# EAGLE design ATmega128RFA1 Dev Board-v11 (EAGLE 5.10)
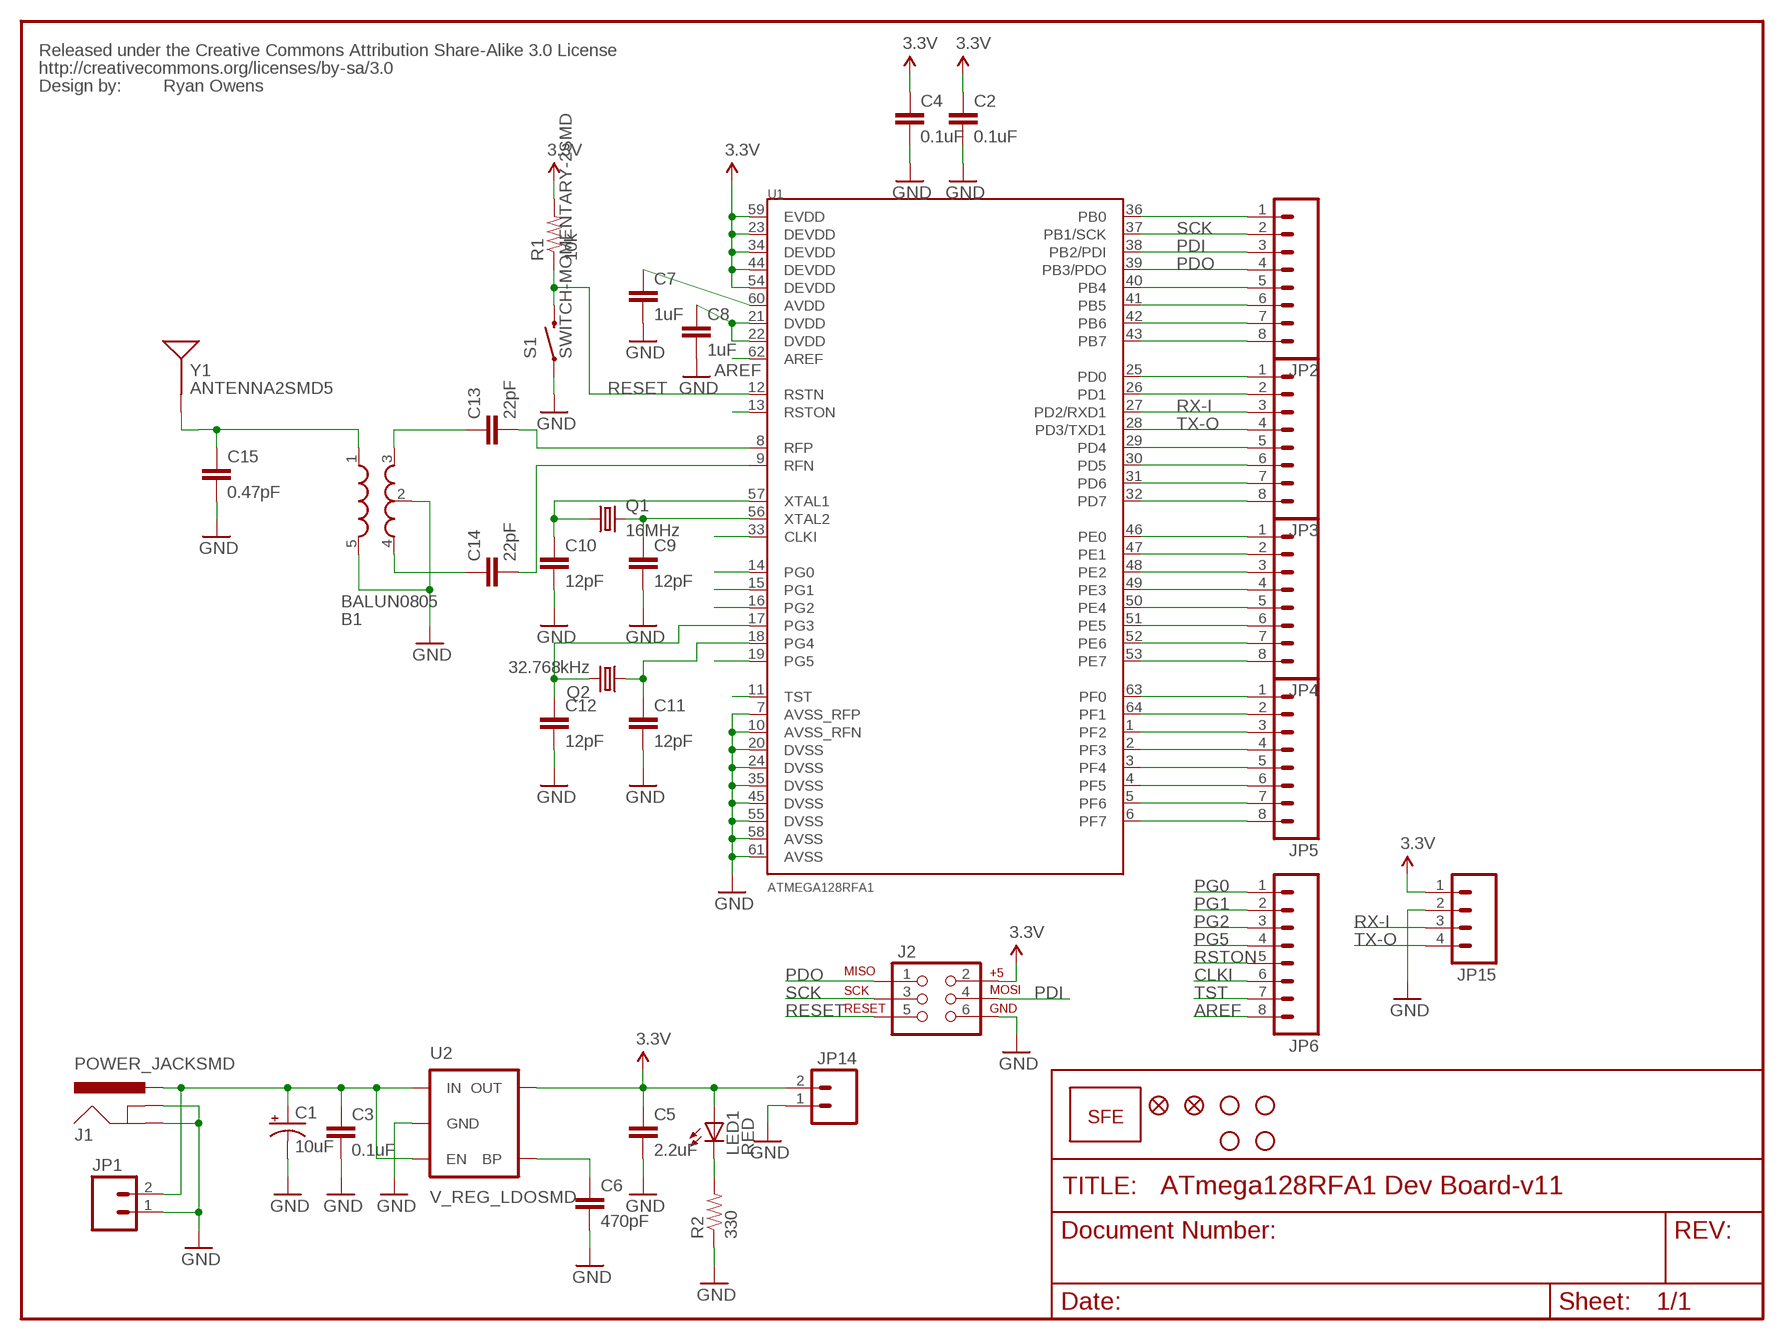
[diagram p0: schematic, sheet 1]

## Parts
B1  BALUN0805  [BALUN]
C1  10uF  CAP_POL1206  [EIA3216]
C2  0.1uF  CAP0603-CAP  [0603-CAP]
C3  0.1uF  CAP0603-CAP  [0603-CAP]
C4  0.1uF  CAP0603-CAP  [0603-CAP]
C5  2.2uF  CAP0603-CAP  [0603-CAP]
C6  470pF  CAP0603-CAP  [0603-CAP]
C7  1uF  CAP0805  [0805]
C8  1uF  CAP0805  [0805]
C9  12pF  CAP0603-CAP  [0603-CAP]
C10  12pF  CAP0603-CAP  [0603-CAP]
C11  12pF  CAP0603-CAP  [0603-CAP]
C12  12pF  CAP0603-CAP  [0603-CAP]
C13  22pF  CAP0603-CAP  [0603-CAP]
C14  22pF  CAP0603-CAP  [0603-CAP]
C15  0.47pF  CAP0603-CAP  [0603-CAP]
J1  POWER_JACKSMD  [POWER_JACK_SMD]
J2  AVR_SPI_PRG_6PTH  [2X3]
JP1  M02PTH  [1X02]
JP2  M08  [1X08]
JP3  M08  [1X08]
JP4  M08  [1X08]
JP5  M08  [1X08]
JP6  M08  [1X08]
JP7  LOGO-SFENEW  [SFE-NEW-WEBLOGO]
JP8  FIDUCIAL1X2  [FIDUCIAL-1X2]
JP9  FIDUCIAL1X2  [FIDUCIAL-1X2]
JP10  STAND-OFF  [STAND-OFF]
JP11  STAND-OFF  [STAND-OFF]
JP12  STAND-OFF  [STAND-OFF]
JP13  STAND-OFF  [STAND-OFF]
JP14  M02PTH  [1X02]
JP15  M04PTH  [1X04]
LED1  RED  LED0603  [LED-0603]
Q1  16MHz  CRYSTAL5X3  [CRYSTAL-SMD-5X3]
Q2  32.768kHz  CRYSTAL32-SMD  [CRYSTAL-32KHZ-SMD]
R1  10k  RESISTOR0603-RES  [0603-RES]
R2  330  RESISTOR0603-RES  [0603-RES]
S1  SWITCH-MOMENTARY-2SMD  [TACTILE_SWITCH_SMD]
U1  ATMEGA128RFA1  [QFN-64]
U2  V_REG_LDOSMD  [SOT23-5]
U$1  CREATIVE_COMMONS  [CREATIVE_COMMONS]
Y1  ANTENNA2SMD5  [ANTENNA-CHIP5]

## Nets
3.3V [Supply]: C2.1 C4.1 C5.1 J2.2 JP14.2 JP15.1 LED1.A R1.2 U1.23(DEVDD) U1.34(DEVDD) U1.44(DEVDD) U1.54(DEVDD) U1.59(EVDD) U2.5(OUT)
AREF: JP6.8 U1.62(AREF)
CLKI: JP6.6 U1.33(CLKI)
GND [Supply]: B1.2(GND) B1.5(GND) C1.C(-) C2.2 C3.2 C4.2 C5.2 C6.2 C7.2 C8.2 C9.2 C10.2 C11.2 C12.2 C15.2 J1.GND(GNDBREAK) J1.P$4(GND) J2.6 JP1.1 JP14.1 JP15.2 R2.1 S1.1 U1.7(AVSS_RFP) U1.10(AVSS_RFN) U1.20(DVSS) U1.24(DVSS) U1.35(DVSS) U1.45(DVSS) U1.55(DVSS) U1.58(AVSS) U1.61(AVSS) U2.2(GND)
N$1: B1.3(OUT1) C13.1
N$2: B1.4(OUT2) C14.1
N$3 [Supply]: C1.A(+) C3.1 J1.VIN0(PWR) JP1.2 U2.1(IN) U2.3(EN)
N$4: B1.1(IN) C15.1 Y1.FEED(SIGNAL)
N$5: C8.1 U1.21(DVDD) U1.22(DVDD)
N$6: C14.2 U1.9(RFN)
N$7: C13.2 U1.8(RFP)
N$8: LED1.C R2.2
N$10: C7.1 U1.60(AVDD)
N$12: C10.1 Q1.1 U1.57(XTAL1)
N$13: C9.1 Q1.3 U1.56(XTAL2)
N$14: C12.1 Q2.X2 U1.17(PG3)
N$15: C11.1 Q2.X1 U1.18(PG4)
N$16: C6.1 U2.4(BP)
N$17: JP2.1 U1.36(PB0)
N$21: JP2.5 U1.40(PB4)
N$22: JP2.6 U1.41(PB5)
N$23: JP2.7 U1.42(PB6)
N$24: JP2.8 U1.43(PB7)
N$25: JP3.1 U1.25(PD0)
N$26: JP3.2 U1.26(PD1)
N$29: JP3.5 U1.29(PD4)
N$30: JP3.6 U1.30(PD5)
N$31: JP3.7 U1.31(PD6)
N$32: JP3.8 U1.32(PD7)
N$33: JP4.1 U1.46(PE0)
N$34: JP4.2 U1.47(PE1)
N$35: JP4.3 U1.48(PE2)
N$36: JP4.4 U1.49(PE3)
N$37: JP4.5 U1.50(PE4)
N$38: JP4.6 U1.51(PE5)
N$39: JP4.7 U1.52(PE6)
N$40: JP4.8 U1.53(PE7)
N$41: JP5.1 U1.63(PF0)
N$42: JP5.2 U1.64(PF1)
N$43: JP5.3 U1.1(PF2)
N$44: JP5.4 U1.2(PF3)
N$45: JP5.5 U1.3(PF4)
N$46: JP5.6 U1.4(PF5)
N$47: JP5.7 U1.5(PF6)
N$48: JP5.8 U1.6(PF7)
PDI: J2.4 JP2.3 U1.38(PB2/PDI)
PDO: J2.1 JP2.4 U1.39(PB3/PDO)
PG0: JP6.1 U1.14(PG0)
PG1: JP6.2 U1.15(PG1)
PG2: JP6.3 U1.16(PG2)
PG5: JP6.4 U1.19(PG5)
RESET: J2.5 R1.1 S1.3 U1.12(RSTN)
RSTON: JP6.5 U1.13(RSTON)
RX-I: JP3.3 JP15.3 U1.27(PD2/RXD1)
SCK: J2.3 JP2.2 U1.37(PB1/SCK)
TST: JP6.7 U1.11(TST)
TX-O: JP3.4 JP15.4 U1.28(PD3/TXD1)

## Notes on the sheet
- Ryan Owens

## Library data of the parts
B1 = SparkFun:BALUN
C1 = SparkFun:CAP_POL: Capacitor Polarized These are standard SMD and PTH capacitors. Normally 10uF, 47uF, and 100uF in electrolytic and tantalum varieties. Always verify the external diameter of the through hole cap, it varies with capacity, voltage, and manufacturer. The EIA devices should be standard.
C2-C15 = SparkFun:CAP: Capacitor Standard 0603 ceramic capacitor, and 0.1" leaded capacitor.
J1 = SparkFun:POWER_JACK: Power Jack This is the standard 5.5mm barrel jack for power. The PTH is the most common, proven, reliable, footprint. All others are experimental. The Slot footprint only works if the mill layer is transmitted to the PCB fab house so be warned. Spark Fun Electronics SKU : PRT-00119. Mating wall wart : TOL-00298 (and others)
J2 = SparkFun:AVR_SPI_PRG_6: AVR ISP 6 Pin This is the reduced ISP connector for AVR programming. Common on Arduino. This footprint will take up less PCB space and can be used with a 10-pin to 6-pin adapter such as SKU: BOB-08508
JP1 JP14 = SparkFun:M02: Header 2 Standard 2-pin 0.1" header. Use with straight break away headers (SKU : PRT-00116), right angle break away headers (PRT-00553), swiss pins (PRT-00743), machine pins (PRT-00117), and female headers (PRT-00115). Molex polarized connector foot print use with SKU : PRT-08233 with associated crimp pins and housings.
JP2-JP6 = SparkFun:M08: Header 8 Standard 8-pin 0.1" header. Use with straight break away headers (SKU : PRT-00116), right angle break away headers (PRT-00553), swiss pins (PRT-00743), machine pins (PRT-00117), and female headers (PRT-00115).
JP7 = SparkFun:LOGO-SFE: Spark Fun Electronics PCB Logo This is the standard Spark Fun Electronics PCB logo.
JP8 JP9 = SparkFun:FIDUCIAL: Fiducial Alignment Points Various fiducial points for machine vision alignment.
JP10-JP13 = SparkFun:STAND-OFF: Stand Off This is the mechanical footprint for a #4 phillips button head screw. Use the keepout ring to avoid running the screw head into surrounding components. SKU : PRT-00447
JP15 = SparkFun:M04: Header 4 Standard 4-pin 0.1" header. Use with straight break away headers (SKU : PRT-00116), right angle break away headers (PRT-00553), swiss pins (PRT-00743), machine pins (PRT-00117), and female headers (PRT-00115). Molex polarized connector foot print use with SKU : PRT-08231 with associated crimp pins and housings.
LED1 = SparkFun:LED: LEDs Standard schematic elements and footprints for 5mm, 3mm, 1206, and 0603 sized LEDs. 5mm - Spark Fun Electronics SKU : COM-00529 (and others)
Q1 Q2 = SparkFun:CRYSTAL: Crystals Various standard crystals. Proven footprints. Spark Fun Electronics SKU : COM-00534
R1 R2 = SparkFun:RESISTOR: Resistor Basic schematic elements and footprints for 0603, 1206, and PTH 1/10th watt (small) resistors.
S1 = SparkFun:SWITCH-MOMENTARY-2
U1 = SparkFun:ATMEGA128RFA1
U2 = SparkFun:V_REG_LDO: Voltage Regulator LDO Standard 150mA LDO voltage regulator in SOT-23 layout. Micrel part MIC5205. BP (by-pass) pin is used to lower output noise with 470pF cap.
U$1 = SparkFun:CREATIVE_COMMONS
Y1 = SparkFun:ANTENNA2: Antenna Single endded antenna. Common with smaller chip antennas. CHIP4 package is the GPS Chip Antenna SKU: GPS-08418. CHIP5 package is 2.4GHz chip antenna SKU: WRL-00144.

## Net classes
1 Supply: width 0.406 mm

## Board
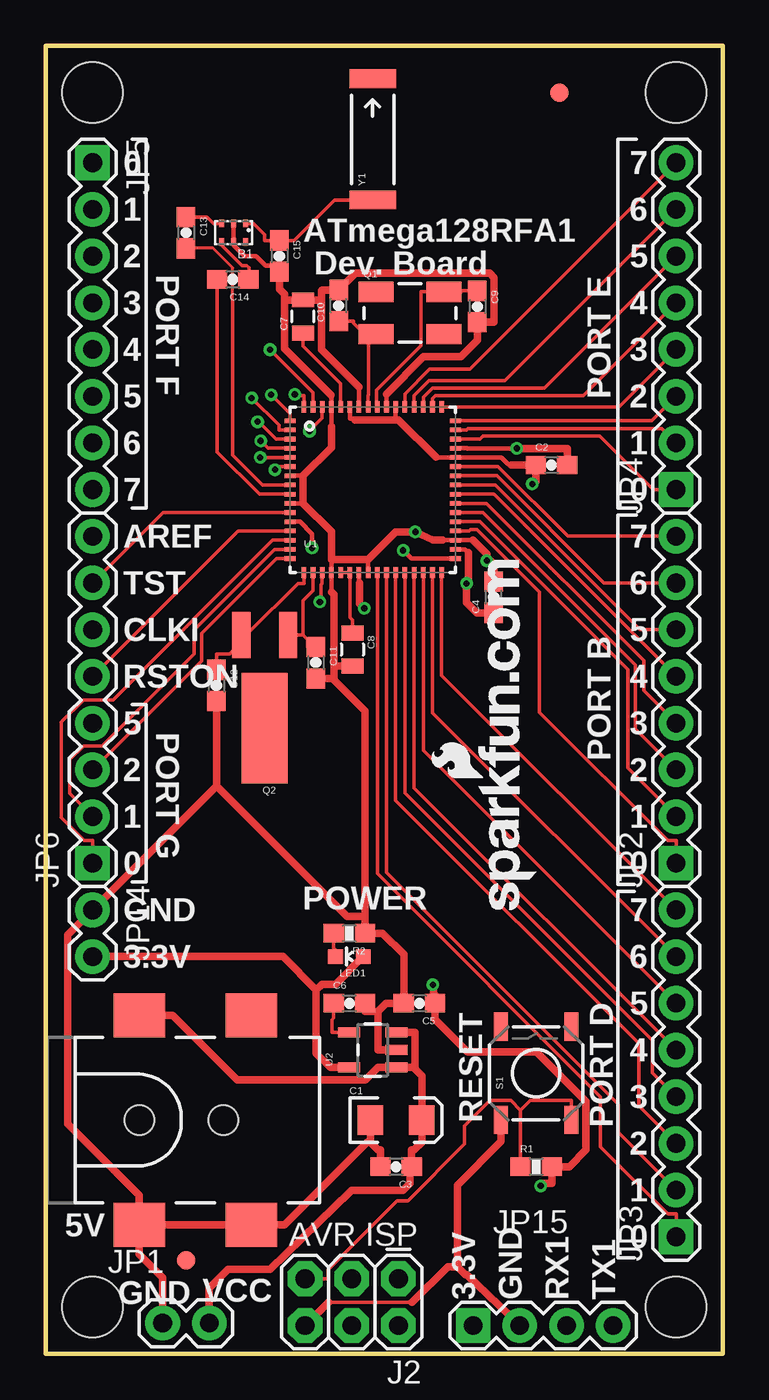
[diagram p1: board, top side]
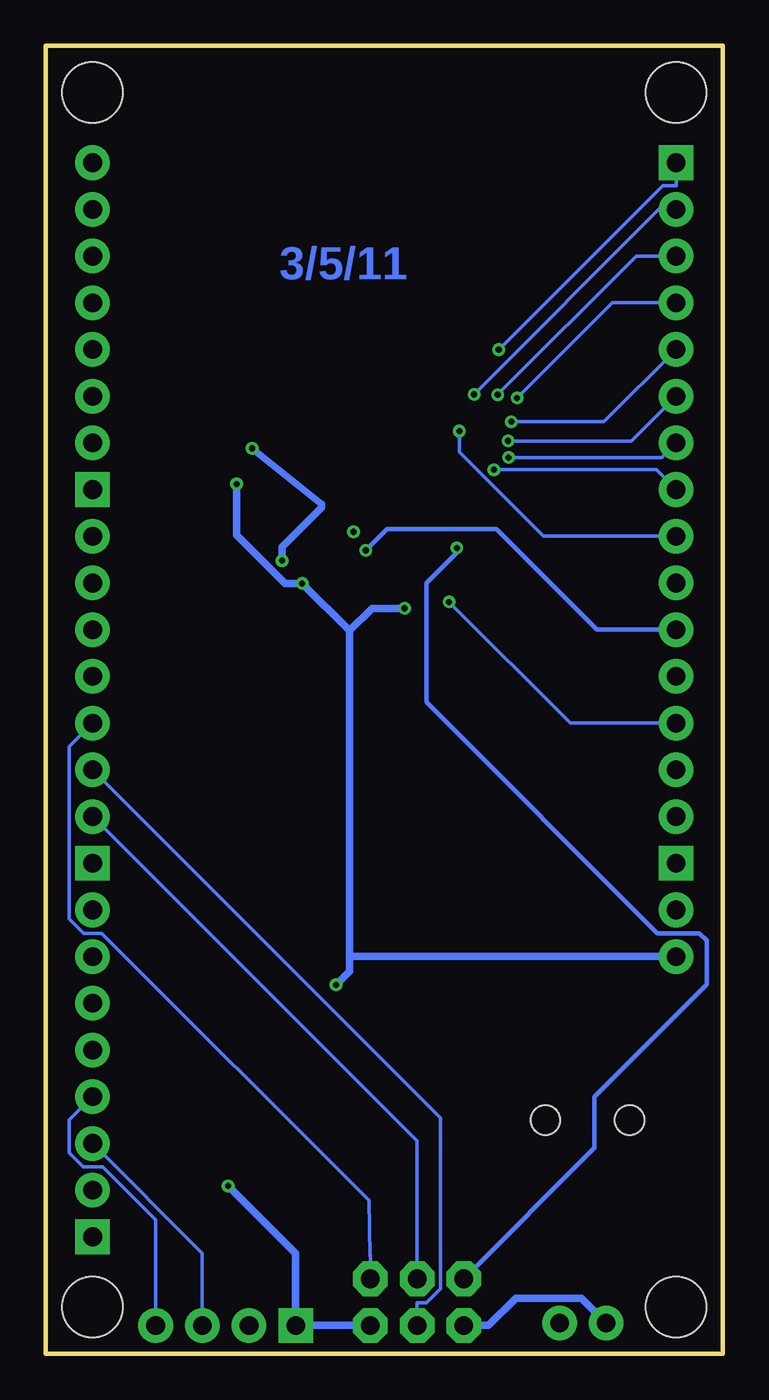
[diagram p2: board, bottom side, seen from below]

Size 36.83 x 71.12 mm. Coordinates in mm from the lower left corner, seen from the top.
Outline: 0,0 0,71.12 36.83,71.12 36.83,0 0,0
Copper layers (1*16): Top 0.0356mm / dielectric 1.5011mm / Bottom 0.0356mm
Design rules "LaenPCBOrder8mil": minimum track width 8mil, minimum drill 13mil, track to track 8mil, track to pad 8mil, pad to pad 8mil, via to via 8mil, smd to smd 6mil, copper to edge 15mil, drill to drill 6mil, minimum pad ring 8mil, minimum via ring 7mil, stop-mask expansion 4mil, vias tented up to drill 0mil, thermal gap 10mil

### Footprints (pad centres in the part's own frame; a part is rotated, then mirrored left to right if it is on the bottom)
BALUN = smd 0.27 x 0.4: 1 -0.7,-0.5; 2 -0.05,-0.5; 3 0.6,-0.5; 4 0.6,0.5; 5 -0.05,0.5; 6 -0.7,0.5
EIA3216 = smd 1.4 x 1.6: A 1.4,0; C -1.4,0
0603-CAP = smd 1.1 x 1: 1 -0.85,0; 2 0.85,0
0805 = smd 0.8 x 1.2: 1 -0.9,0; 2 0.9,0
POWER_JACK_SMD = smd 2.8 x 2.4: GND 0,-5.7; P$4 6.1,-5.7; VIN0 0,5.7; VIN1 6.1,5.7 | hole 1.6: 0,0; 4.572,0
2X3 = drill 1.016 pad 1.88 octagon: 1 0,0; 2 0,2.54; 3 2.54,0; 4 2.54,2.54; 5 5.08,0; 6 5.08,2.54
1X02 = drill 1.016 pad 1.88 round: 1 0,0; 2 2.54,0
1X08 = drill 1.016 pad 1.88 square: 1 0,0 | drill 1.016 pad 1.88 round: 2 2.54,0; 3 5.08,0; 4 7.62,0; 5 10.16,0; 6 12.7,0; 7 15.24,0; 8 17.78,0
FIDUCIAL-1X2 = smd 1 x 1: 1 0,0
STAND-OFF = hole 3.302: 0,0
1X04 = drill 1.016 pad 1.88 square: 1 0,0 | drill 1.016 pad 1.88 round: 2 2.54,0; 3 5.08,0; 4 7.62,0
LED-0603 = smd 0.8 x 0.8: A 0,-0.75; C 0,0.75
CRYSTAL-SMD-5X3 = smd 1.9 x 1.1: 1 -1.85,-1.15; 2 1.85,-1.15; 3 1.85,1.15; 4 -1.85,1.15
CRYSTAL-32KHZ-SMD = smd 2.5 x 6: SHEILD 0,5.08 | smd 1 x 2.5: X1 -1.27,0; X2 1.27,0
0603-RES = smd 1.1 x 1: 1 -0.85,0; 2 0.85,0
TACTILE_SWITCH_SMD = smd 1.524 x 0.762: 1 -2.54,1.905; 2 2.54,1.905; 3 -2.54,-1.905; 4 2.54,-1.905
QFN-64 = smd 0.6 x 0.25: 1 -4.5,3.75; 2 -4.5,3.25; 3 -4.5,2.75; 4 -4.5,2.25; 5 -4.5,1.75; 6 -4.5,1.25; 7 -4.5,0.75; 8 -4.5,0.25; 9 -4.5,-0.25; 10 -4.5,-0.75; 11 -4.5,-1.25; 12 -4.5,-1.75; 13 -4.5,-2.25; 14 -4.5,-2.75; 15 -4.5,-3.25; 16 -4.5,-3.75; 33 4.5,-3.75; 34 4.5,-3.25; 35 4.5,-2.75; 36 4.5,-2.25; 37 4.5,-1.75; 38 4.5,-1.25; 39 4.5,-0.75; 40 4.5,-0.25; 41 4.5,0.25; 42 4.5,0.75; 43 4.5,1.25; 44 4.5,1.75; 45 4.5,2.25; 46 4.5,2.75; 47 4.5,3.25; 48 4.5,3.75 | smd 0.25 x 0.6: 17 -3.75,-4.5; 18 -3.25,-4.5; 19 -2.75,-4.5; 20 -2.25,-4.5; 21 -1.75,-4.5; 22 -1.25,-4.5; 23 -0.75,-4.5; 24 -0.25,-4.5; 25 0.25,-4.5; 26 0.75,-4.5; 27 1.25,-4.5; 28 1.75,-4.5; 29 2.25,-4.5; 30 2.75,-4.5; 31 3.25,-4.5; 32 3.75,-4.5; 49 3.75,4.5; 50 3.25,4.5; 51 2.75,4.5; 52 2.25,4.5; 53 1.75,4.5; 54 1.25,4.5; 55 0.75,4.5; 56 0.25,4.5; 57 -0.25,4.5; 58 -0.75,4.5; 59 -1.25,4.5; 60 -1.75,4.5; 61 -2.25,4.5; 62 -2.75,4.5; 63 -3.25,4.5; 64 -3.75,4.5
SOT23-5 = smd 0.55 x 1.2: 1 -0.95,-1.3; 2 0,-1.3; 3 0.95,-1.3; 4 0.95,1.3; 5 -0.95,1.3
ANTENNA-CHIP5 = smd 1.016 x 2.54: FEED -3.302,0; NC 3.302,0

### Placement (x,y rotation side)
B1  10.16,60.96 180 top
C1  19.05,12.7 0 top
C2  27.51,48.33 0 top
C3  19.05,10.16 180 top
C4  24.36,41.14 90 top
C5  20.32,19.05 180 top
C6  16.51,19.05 0 top
C7  13.98,56.41 90 top
C8  16.67,38.29 270 top
C9  23.47,56.95 270 top
C10  15.92,57 90 top
C11  14.68,37.57 270 top
C12  9.27,36.35 270 top
C13  7.62,60.96 270 top
C14  10.16,58.42 180 top
C15  12.7,59.69 270 top
J1  5.08,12.7 0 top
J2  19.18,4.06 180 top
JP1  6.35,1.65 0 top
JP2  34.29,26.67 90 top
JP3  34.29,6.35 90 top
JP4  34.29,46.99 90 top
JP5  2.54,64.77 270 top
JP6  2.54,26.67 90 top
JP7  26.67,24.13 90 top
JP8  7.62,5.08 0 top
JP9  27.94,68.58 0 top
JP10  2.54,2.54 0 top
JP11  34.29,2.54 0 top
JP12  2.54,68.58 0 top
JP13  34.29,68.58 0 top
JP14  2.54,24.13 270 top
JP15  23.24,1.52 0 top
LED1  16.51,21.59 90 top
Q1  19.81,56.6 0 top
Q2  11.9,39.09 180 top
R1  26.67,10.16 0 top
R2  16.51,22.86 180 top
S1  26.67,15.24 90 top
U1  17.78,46.99 0 top
U2  17.78,16.51 90 top
U$1  19.05,-35.56 0 top  (outside the outline)
Y1  17.78,66.04 90 top

### Tracks (layer width: path | path; a pad name or v marks a point on that pad's centre or on a via)
3.3V  (via drill 0.33 pad 0.69)
  Top 0.25: U1.23 17.03,41.95 17.06,41.92 | 19.03,50.79 U1.54 | U1.59 16.53,50.86 16.73,50.86 16.8,50.78 | U1.34 22.81,43.74 22.99,43.55 | 21.21,48.77 21.24,48.74 U1.44 24.79,48.74 25.15,48.39 25.21,48.33 25.33,48.33
  Top 0.406: 17.06,41.92 17.06,40.79 v17.32,40.53 | 16.8,50.78 19.03,50.78 | 19.03,50.78 19.03,50.79 | v26.46,47.3 26.58,47.42 26.66,47.42 C2.1 25.33,48.33 | 21.09,20.01 21.09,19.58 21.17,19.5 C5.1 21.17,18.17 22.94,16.4 26.69,16.4 29.38,13.71 29.38,11.07 28.48,10.16 R1.2 27.52,9.25 27.05,9.25 v26.92,9.12 | 21.09,20.01 | 21.09,20.01 v21.05,20.06 | 22.99,43.55 22.99,41.99 v22.89,41.88 22.89,40.86 23.46,40.29 C4.1 | 14.7,19.78 15.01,20.08 15.75,20.08 LED1.A | 14.7,19.78 14.7,16.33 15.47,15.56 U2.5 | JP14.2 12.89,21.59 14.7,19.78 | 19.03,50.78 19.19,50.78 21.21,48.77
  Bottom 0.406: 20.32,39.32 19.1,40.53 v17.32,40.53 | v26.46,47.3 26.46,44.53 23.81,41.88 v22.89,41.88 20.32,39.32 | 20.32,21.59 20.32,39.32 | J2.2 20.52,1.52 JP15.1 23.24,5.44 v26.92,9.12 | 20.32,21.59 20.32,20.78 v21.05,20.06 | 20.32,21.59 JP14.2
AREF  (via drill 0.33 pad 0.69)
  Top 0.203: v14.34,50.17 14.34,50.2 15.03,50.88 U1.62
  Bottom 0.203: JP6.8 9.76,44.45 14.34,49.03 v14.34,50.17
CLKI  (via drill 0.33 pad 0.69)
  Top 0.25: U1.33 19.88,43.24 v19.43,43.69
  Bottom 0.25: v19.43,43.69 18.29,44.83 12.32,44.83 12.19,44.7 6.86,39.37 JP6.6
GND  (via drill 0.33 pad 0.69)
  Top 0.203: 15.37,2.79 19.93,2.79
  Top 0.25: 13.99,47.74 U1.7 | 15.53,50.43 U1.61 15.53,52.12 15.52,52.12 | 17.03,52.55 U1.58 | 21.57,44.24 U1.35 23.23,44.24 | U1.45 22.91,49.24 22.91,49.23 v25.61,49.23 | 17.53,43.2 U1.24 | 15.53,41.43 U1.20 15.53,43.2 | 18.53,52.2 U1.55 | 13.99,46.24 U1.10 | B1.2 B1.5 10.21,60.27 10.79,59.69 11.43,59.69 11.94,59.18 12.36,59.18 C15.2
  Top 0.406: v23.99,43.12 23.99,43.48 23.23,44.24 | 17.36,23.77 17.36,34.95 15.59,36.72 | 15.59,36.72 15.67,36.8 15.67,37.39 | U2.2 18.07,16.51 18.07,18.58 18.06,18.6 | 18.06,18.6 18.51,19.05 C5.2 19.47,21.71 18.32,22.86 R2.1 17.36,23.77 | 18.06,18.6 17.36,18.6 C6.2 | v23.99,43.12 24.18,43.12 24.36,42.95 C4.2 | v23.99,43.12 | 15.53,50.43 15.53,49.28 13.99,47.74 13.99,46.24 15.53,44.7 15.53,43.2 17.53,43.2 19.03,44.69 v20.09,44.69 21.06,44.24 21.57,44.24 | 17.03,52.55 14.98,54.6 14.98,57.3 | 14.98,57.3 C7.2 13.48,57.3 12.97,57.3 | 14.98,57.3 14.98,57.82 15.02,57.85 C10.2 16.83,58.76 24.15,58.76 24.37,58.53 24.37,56.1 C9.2 23.47,55.11 22.57,54.22 20.55,54.22 18.53,52.2 | 17.65,11.49 18.08,11.07 18.2,11.07 C3.2 | 17.65,11.49 17.48,11.49 12.99,7 J1.P$4 6.89,7 J1.GND | 17.65,11.49 C1.C | 9.27,30.86 16.37,23.77 17.36,23.77 | 9.27,30.86 C12.2 | 9.27,30.86 JP14.1 1.18,22.77 1.18,12.5 5.08,8.61 J1.GND | 12.97,57.3 12.97,54.67 15.52,52.12 | 12.97,57.3 12.97,57.61 12.7,57.88 C15.2 | v25.61,49.23 26.6,49.23 28.36,49.23 C2.2 | 15.67,37.39 15.67,41.29 15.53,41.43 | 15.67,37.39 15.82,37.39 C8.2 | 22.38,4.73 22.38,9.14 24.77,11.53 S1.1 | 22.38,4.73 22.82,4.29 22.92,4.29 JP15.2 | 19.93,2.79 21.86,4.73 22.38,4.73 | 15.59,36.72 C11.2 | J1.GND 5.08,5.39 6.35,4.12 JP1.1 | J2.6 15.37,2.79
  Bottom 0.406: v23.99,43.12 23.99,43.86 21.83,46.02 21.83,46.21 v25.61,49.23 | J2.6 12.75,1.52 11.27,3 7.7,3 JP1.1
N$1
  Top 0.203: B1.3 9.12,61.46 8.77,61.81 C13.1
N$2
  Top 0.203: C14.1 11.05,58.46 11.05,59.05 10.92,59.18 10.67,59.18 9.56,60.29 B1.4
N$3
  Top 0.406: U2.3 20.09,17.46 20.09,15.65 20,15.56 | 20,15.56 20.45,15.11 20.45,13.91 C1.A 20.45,11.49 20.02,11.07 19.9,11.07 C3.1 19.81,10.07 19.81,9.27 19.43,8.89 17.27,8.89 16.64,8.89 16.53,8.78 12.19,4.57 9.91,4.57 8.89,3.56 JP1.2 | 20,15.56 U2.1 18.07,15.56 17.39,14.88 10.41,14.88 6.89,18.4 J1.VIN0
N$4
  Top 0.203: Y1.FEED 15.7,62.74 13.51,60.54 C15.1 11.89,60.54 11.89,60.87 11.3,61.46 B1.1
N$5
  Top 0.203: U1.21 U1.22 16.53,40.04 16.67,39.9 C8.1
N$6
  Top 0.203: C14.2 9.31,49.04 11.61,46.74 U1.9
N$7
  Top 0.152: 10.16,57.21 10.16,59.05 9.11,60.11 C13.2
  Top 0.203: 10.16,57.21 10.16,48.87 11.79,47.24 U1.8
N$8
  Top 0.203: R2.2 15.66,22.05 15.76,21.95 LED1.C
N$10
  Top 0.203: U1.60 16.03,52.75 13.98,54.8 C7.1
N$12
  Top 0.203: C10.1 16.73,56.15 16.73,56.06 17.34,55.45 | 17.34,55.45 17.56,55.23 17.56,52.12 17.53,52.09 U1.57 | 17.34,55.45 Q1.1
N$13
  Top 0.203: U1.56 17.99,51.53 17.99,52.4 20.41,54.82 20.41,57.75 Q1.3 22.61,57.75 22.66,57.8 C9.1
N$14
  Top 0.203: U1.17 14.03,41.88 13.72,41.88 11.04,39.2 11.04,39.09 | C12.1 9.27,38.05 10,38.05 11.04,39.09 | 11.04,39.09 Q2.X2
N$15
  Top 0.203: U1.18 14.53,41.51 13.98,40.96 13.98,39.09 | 13.98,39.09 14.24,38.82 14.24,38.42 C11.1 | Q2.X1 13.98,39.09
N$16
  Top 0.203: C6.1 15.66,18.25 15.57,18.16 15.57,17.46 U2.4
N$17
  Top 0.203: U1.36 23.01,44.74 23.09,44.83 23.45,44.83 26.86,41.41 26.86,34.88 33.82,27.91 34.29,27.91 JP2.1
N$21
  Top 0.203: JP2.5 24.37,46.74 U1.40
N$22
  Top 0.203: JP2.6 32.32,39.37 24.45,47.24 U1.41
N$23
  Top 0.203: JP2.7 30.35,41.91 24.52,47.74 22.89,47.74 U1.42
N$24
  Top 0.203: JP2.8 28.39,44.45 24.6,48.24 U1.43
N$25
  Top 0.203: JP3.1 34.29,7.59 33.82,7.59 30.18,11.24 30.18,13.96 18.03,26.1 U1.25
N$26
  Top 0.203: 18.53,41.88 U1.26 | JP3.2 31.14,12.04 31.14,13.56 18.53,26.18 18.53,41.88 | 18.53,41.88
N$29
  Top 0.203: JP3.5 20.03,30.77 U1.29
N$30
  Top 0.203: JP3.6 20.53,32.81 U1.30
N$31
  Top 0.203: JP3.7 21.03,34.85 U1.31
N$32
  Top 0.203: U1.32 21.53,36.89 JP3.8
N$33
  Top 0.203: U1.46 23.62,49.74 23.78,49.9 30.14,49.9 33.05,46.99 JP4.1
N$34
  Top 0.203: U1.47 22.89,50.24 22.95,50.3 33.52,50.3 JP4.2
N$35
  Top 0.203: JP4.3 32.96,50.74 22.89,50.74 U1.48
N$36
  Top 0.203: U1.49 31.17,51.49 JP4.4
N$37
  Top 0.203: U1.50 21.03,51.93 21.19,52.09 29.23,52.09 JP4.5
N$38
  Top 0.203: JP4.6 27.11,52.51 21.03,52.51 20.53,52.01 U1.51
N$39
  Top 0.203: JP4.7 24.98,52.92 20.84,52.92 20.03,52.11 U1.52
N$40
  Top 0.203: JP4.8 23.05,53.53 20.88,53.53 19.53,52.19 U1.53
N$41  (via drill 0.33 pad 0.69)
  Top 0.203: U1.63 14.53,52.27 v12.2,54.6
  Bottom 0.203: v12.2,54.6 3.27,63.52 2.54,63.52 JP5.1
N$42  (via drill 0.33 pad 0.69)
  Top 0.203: U1.64 14.03,52.09 13.61,52.09 v13.54,52.17
  Bottom 0.203: JP5.2 3.48,62.23 v13.54,52.17
N$43  (via drill 0.33 pad 0.69)
  Top 0.203: U1.1 13.28,51.12 v12.25,52.15
  Bottom 0.203: v12.25,52.15 4.71,59.69 JP5.3
N$44  (via drill 0.33 pad 0.69)
  Top 0.203: v11.2,51.97 12.68,50.49 12.68,50.24 U1.2
  Bottom 0.203: JP5.4 6.02,57.15 v11.2,51.97
N$45  (via drill 0.33 pad 0.69)
  Top 0.203: v11.51,50.68 11.57,50.68 12.51,49.74 12.68,49.74 U1.3
  Bottom 0.203: JP5.5 6.47,50.68 v11.51,50.68
N$46  (via drill 0.33 pad 0.69)
  Top 0.203: v11.69,49.64 12.09,49.24 12.68,49.24 U1.4
  Bottom 0.203: JP5.6 4.97,49.64 v11.69,49.64
N$47  (via drill 0.33 pad 0.69)
  Top 0.203: v11.66,48.74 U1.5
  Bottom 0.203: JP5.7 3.33,48.74 v11.66,48.74
N$48  (via drill 0.33 pad 0.69)
  Top 0.203: v12.46,48.07 12.51,48.07 12.68,48.24 U1.6
  Bottom 0.203: JP5.8 3.62,48.07 v12.46,48.07
PDI
  Top 0.203: JP2.3 32.06,33.98 32.06,37.45 23.77,45.74 U1.38
  Bottom 0.203: J2.4 16.64,2.77 16.12,2.77 15.37,3.52 15.37,12.83 JP2.3
PDO
  Top 0.203: JP2.4 32.53,36.05 32.53,37.69 23.98,46.24 22.89,46.24 U1.39
  Bottom 0.203: J2.1 19.18,5.31 19.2,5.31 19.25,8.32 33.79,22.86 34.78,22.86 35.56,23.64 35.56,33.02 JP2.4
PG0
  Top 0.203: U1.14 12.33,44.24 3.65,35.56 2.04,35.56 0.84,34.36 0.84,29.14 2.07,27.91 2.54,27.91 JP6.1
PG1
  Top 0.203: JP6.2 1.29,30.45 1.29,32.3 2.04,33.05 3.06,33.05 8.06,38.04 8.06,39.35 12.45,43.74 U1.15
PG2
  Top 0.203: JP6.3 8.47,37.68 8.47,39.16 12.55,43.24 U1.16
PG5  (via drill 0.33 pad 0.69)
  Top 0.203: v14.9,40.88 14.97,40.95 14.97,41.82 15.03,41.88 U1.19
  Bottom 0.203: JP6.4 8.31,34.29 v14.9,40.88
RESET  (via drill 0.33 pad 0.69)
  Top 0.203: 25.82,13.24 25.29,13.77 24.16,13.77 22.77,12.37 22.77,11.39 19.69,8.31 19.1,8.31 15.34,4.56 15.34,4.06 J2.5 | 25.82,13.24 R1.1 | 25.82,13.24 26.35,13.77 28.57,13.77 S1.3
  Top 0.25: U1.12 13.81,45.24 14.48,44.58 v14.48,43.81
  Bottom 0.25: v14.48,43.81 14.48,43.56 16.13,41.91 16.13,35.43 3.56,22.86 1.27,22.86 0.89,22.48 0.89,20.07 6.99,13.97 6.99,11.18 J2.5
RSTON
  Top 0.203: U1.13 10.45,44.74 JP6.5
RX-I
  Top 0.203: JP3.3 32.26,13.46 32.26,16.86 19.03,30.09 U1.27
  Bottom 0.203: JP3.3 28.32,5.46 JP15.3
SCK
  Top 0.203: JP2.2 31.66,31.84 | 31.66,31.84 | 31.66,31.84 31.66,37.2 23.62,45.24 22.89,45.24 U1.37
  Bottom 0.203: JP2.2 16.64,11.56 J2.3
TST
  Top 0.203: JP6.7 6.37,45.74 U1.11
TX-O
  Top 0.203: JP3.4 32.99,15.27 32.99,17.02 19.53,30.49 U1.28
  Bottom 0.203: JP3.4 35.55,12.71 35.55,10.92 34.8,10.16 33.75,10.16 30.86,7.28 JP15.4

### Text on the board
Bottom: 3/5/11
tPlace: 0 | 7 | 1 | ATmega128RFA1 | 6 | 2 | PORT F | Dev. Board | 5 | 3 | 4 | 4 | 3 | PORT E | 5 | 2 | 6 | 1 | 7 | 0 | AREF | 7 | TST | 6 | CLKI | 5 | RSTON | 4 | 5 | PORT G | 3 | PORT B | 2 | 2 | 1 | 1 | 0 | 0 | POWER | GND | 7 | 3.3V | 6 | 5 | 4 | RESET | 3 | PORT D | 2 | 1 | 5V | AVR ISP | 0 | GND | VCC | 3.3V | GND | RX1 | TX1
tValues: Ryan Owens